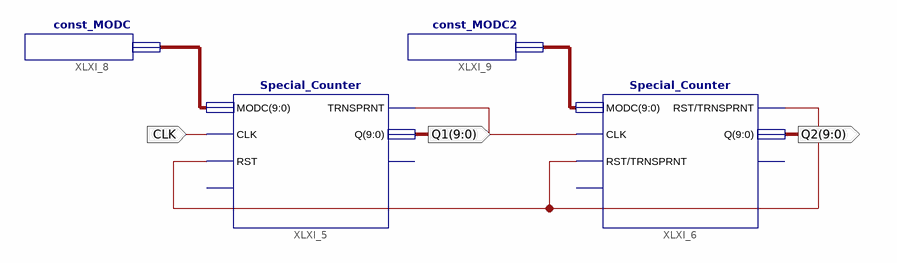
[diagram p0: schematic sheet 1]
// Xilinx ISE schematic TEST.sch (spartan6) as structural Verilog: 4 symbols, 3 ports
module TEST (
  input  CLK,
  output [9:0] Q1,
  output [9:0] Q2
);

  wire XLXN_10, XLXN_15;
  wire [9:0] XLXN_8, XLXN_9;

  Special_Counter XLXI_6 (
    .CLK(XLXN_10), .RST(XLXN_15), .MODC(XLXN_9), .TRNSPRNT(XLXN_15), .Q(Q2));  // open: ENDCOUNT, STATE
  Special_Counter XLXI_5 (
    .CLK(CLK), .RST(XLXN_15), .MODC(XLXN_8), .TRNSPRNT(XLXN_10), .Q(Q1));  // open: ENDCOUNT, STATE
  const_MODC XLXI_8 (.MODC(XLXN_8));
  const_MODC2 XLXI_9 (.MODC(XLXN_9));
endmodule
